# EAGLE design accel-sd-gyro (EAGLE 7.6.0)
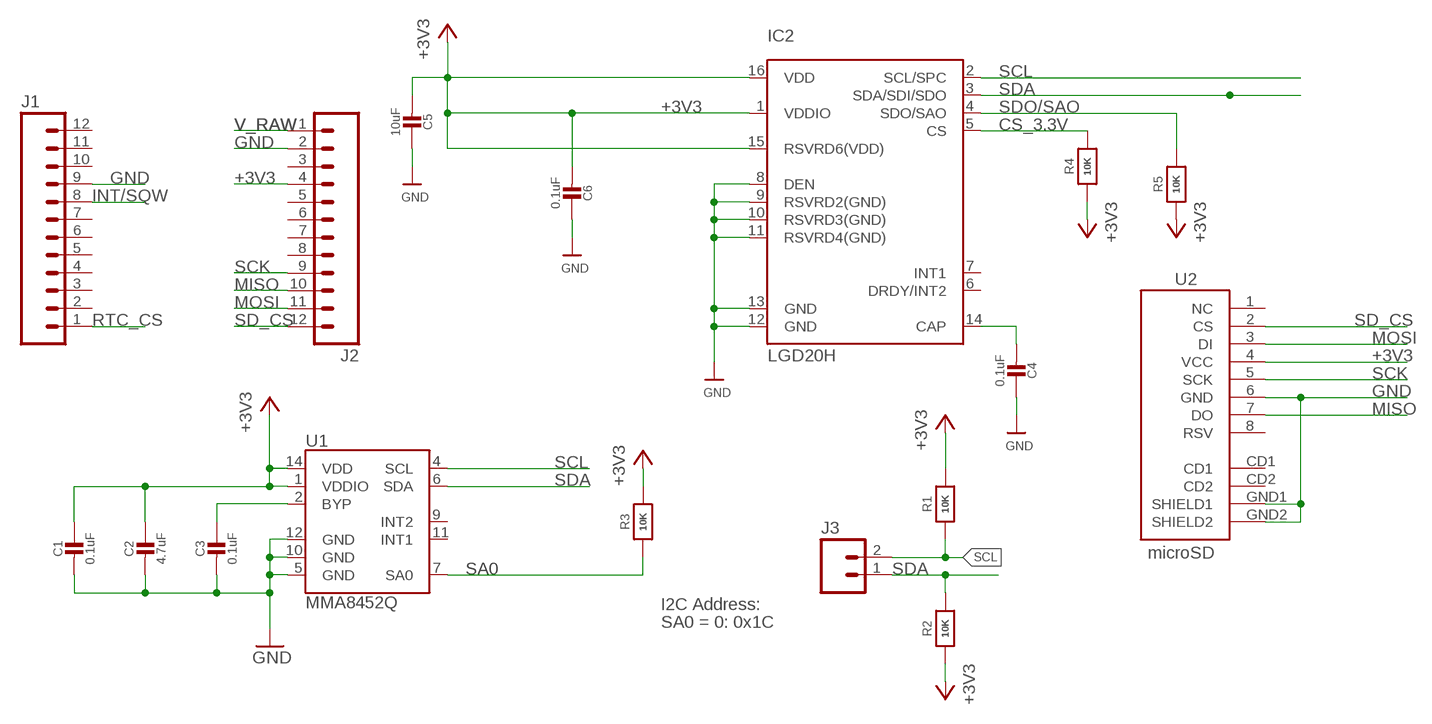
[diagram p0: schematic, sheet 1]

## Parts
C1  0.1uF  CAP_CERAMIC0805-NOOUTLINE  [0805-NO]
C2  4.7uF  CAP_CERAMIC0805-NOOUTLINE  [0805-NO]
C3  0.1uF  CAP_CERAMIC0805-NOOUTLINE  [0805-NO]
C4  0.1uF  CAP_CERAMIC0805-NOOUTLINE  [0805-NO]
C5  10uF  CAP_CERAMIC0805-NOOUTLINE  [0805-NO]
C6  0.1uF  CAP_CERAMIC0805-NOOUTLINE  [0805-NO]
IC2  LGD20H  GYRO_L3GD20H  [L3GD20H_LGA16L]
J1  M12PTH  [1X12]
J2  M12PTH  [1X12]
J3  M02LOCK  [1X02_LOCK]
R1  10K  RESISTOR0805_NOOUTLINE  [0805-NO]
R2  10K  RESISTOR0805_NOOUTLINE  [0805-NO]
R3  10K  RESISTOR_0805MP  [_0805MP]
R4  10K  RESISTOR0805_NOOUTLINE  [0805-NO]
R5  10K  RESISTOR0805_NOOUTLINE  [0805-NO]
U1  MMA8452Q  [QFN-16_0.5MM]
U2  microSD  USD-SOCKETSMD  [MICRO-SD-SOCKET-PP]

## Nets
+3V3: C1.1 C2.1 C5.2 C6.2 IC2.1(VDDIO) IC2.15(RSVRD6(VDD)) IC2.16(VDD) J2.4 R1.2 R2.1 R3.2 R4.1 R5.1 U1.1(VDDIO) U1.14(VDD) U2.4(VCC)
BYP: C3.1 U1.2(BYP)
CS_3.3V: IC2.5(CS) R4.2
GND: C1.2 C2.2 C3.2 C4.1 C5.1 C6.1 IC2.8(DEN) IC2.9(RSVRD2(GND)) IC2.10(RSVRD3(GND)) IC2.11(RSVRD4(GND)) IC2.12(GND) IC2.13(GND) J1.9 J2.2 U1.5(GND) U1.10(GND) U1.12(GND) U2.6(GND) U2.GND1(SHIELD1) U2.GND2(SHIELD2)
INT/SQW: J1.8
MISO: J2.10 U2.7(DO)
MOSI: J2.11 U2.3(DI)
N$3: C4.2 IC2.14(CAP)
RTC_CS: J1.1
SA0: R3.1 U1.7(SA0)
SCK: J2.9 U2.5(SCK)
SCL: IC2.2(SCL/SPC) J3.2 R1.1 U1.4(SCL)
SD_CS: J2.12 U2.2(CS)
SDA: IC2.3(SDA/SDI/SDO) J3.1 R2.2 U1.6(SDA)
SDO/SAO: IC2.4(SDO/SAO) R5.2
V_RAW: J2.1
Unconnected: IC2.6(DRDY/INT2) IC2.7(INT1) J1.2 J1.3 J1.4 J1.5 J1.6 J1.7 J1.10 J1.11 J1.12 J2.3 J2.5 J2.6 J2.7 J2.8 U1.9(INT2) U1.11(INT1) U2.1(NC) U2.8(RSV) U2.CD1 U2.CD2

## Notes on the sheet
- I2C Address:
- SA0 = 0: 0x1C

## Library data of the parts
C1-C6 = microbuilder:CAP_CERAMIC: Ceramic Capacitors For new designs, use the packages preceded by an '_' character since they are more reliable: The following footprints should be used on most boards: _0402 - Standard footprint for regular board layouts _0603 - Standard footprint for regular board layouts _0805 - Standard footprint for regular board layouts _1206 - Standard footprint for regular board layouts For extremely tight-pitch boards where space is at a premium, the following 'micro-pitch' footprints can be used (smaller pads, no silkscreen outline, etc.): _0402MP - Micro-pitch footprint for very dense/compact boards _0603MP - Micro-pitch footprint for very dense/compact boards _0805MP - Micro-pitch footprint for very dense/compact boards _1206MP - Micro-pitch footprint for very dense/compact boards
IC2 = microbuilder:GYRO_L3GD20H: L3GD20H - 3 Axis Gyro
J1 J2 = SparkFun-Connectors:M12: Header 12 Standard 12-pin 0.1" header. Use with straight break away headers (SKU : PRT-00116), right angle break away headers (PRT-00553), swiss pins (PRT-00743), machine pins (PRT-00117), and female headers (PRT-00115).
J3 = SparkFun-Connectors:M02: Standard 2-pin 0.1" header. Use with - straight break away headers ( PRT-00116) - right angle break away headers (PRT-00553) - swiss pins (PRT-00743) - machine pins (PRT-00117) - female headers (PRT-00115) Molex polarized connector foot print use with: PRT-08233 with associated crimp pins and housings. 2.54_SCREWTERM for use with PRT-10571. 3.5mm Screw Terminal footprints for PRT-08084 5mm Screw Terminal footprints for use with PRT-08432
R1-R5 = microbuilder:RESISTOR: Resistors For new designs, use the packages preceded by an '_' character since they are more reliable: The following footprints should be used on most boards: _0402 - Standard footprint for regular board layouts _0603 - Standard footprint for regular board layouts _0805 - Standard footprint for regular board layouts _1206 - Standard footprint for regular board layouts For extremely tight-pitch boards where space is at a premium, the following 'micro-pitch' footprints can be used (smaller pads, no silkscreen outline, etc.): _0402MP - Micro-pitch footprint for very dense/compact boards _0603MP - Micro-pitch footprint for very dense/compact boards _0805MP - Micro-pitch footprint for very dense/compact boards _1206MP - Micro-pitch footprint for very dense/compact boards
U1 = SparkFun:MMA8452Q: MMA8452Q 3-Axis, 12/8-bit Digital Accelerometer Supply Voltage: 1.6-3.6V Range: +/- 2g, 4g, 8g Interface: I2C, 12-bit and 8-bit ODR: 1.56 Hz - 800 Hz Package: QFN-16 http://cache.freescale.com/files/sensors/doc/data_sheet/MMA8452Q.pdf
U2 = SparkFun:USD-SOCKET: microSD Socket Push-push type uSD socket. Schematic element and footprint production proven. Spark Fun Electronics SKU : PRT-00127. tDoc lines correctly indicate media card edge positions when inserting (unlocked, locked, depressed).

## Net classes
1 vcc: width 0.254 mm

## Board
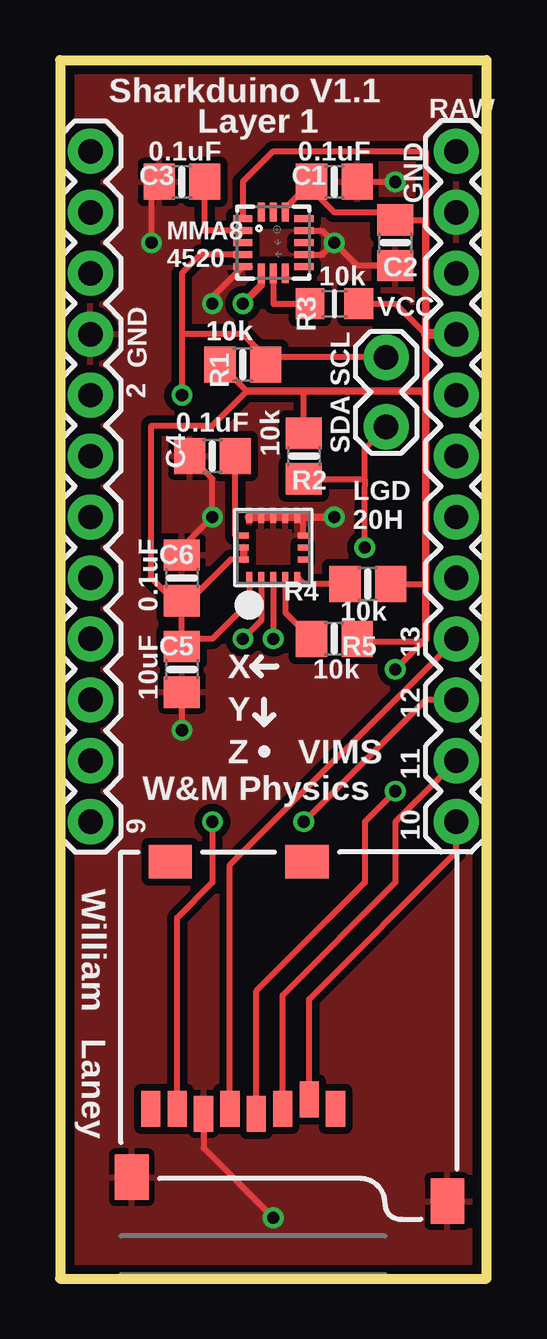
[diagram p1: board, top side]
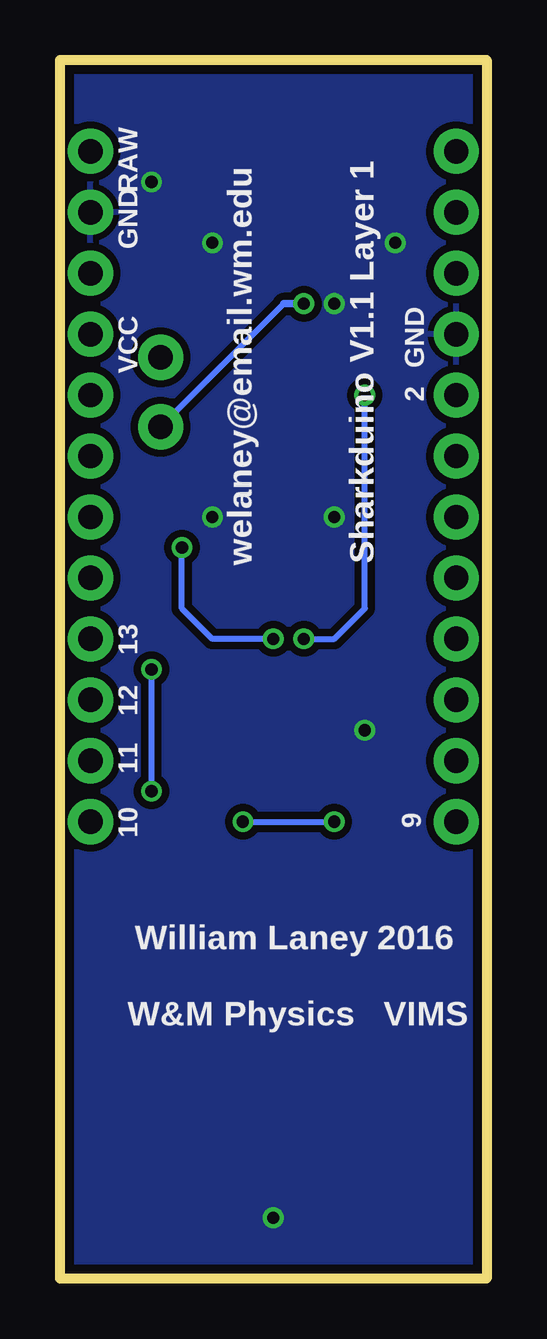
[diagram p2: board, bottom side, seen from below]

Size 17.78 x 50.8 mm. Coordinates in mm from the lower left corner, seen from the top.
Outline: 0,50.8 17.78,50.8 17.78,0 0,0 0,50.8
Copper layers (1*16): Top 0.0356mm / dielectric 1.5011mm / Bottom 0.0356mm
Design rules "oshpark-2layer": minimum track width 6mil, minimum drill 13mil, track to track 6mil, track to pad 6mil, pad to pad 6mil, via to via 6mil, smd to smd 6mil, copper to edge 15mil, drill to drill 6mil, minimum pad ring 7mil, minimum via ring 7mil, stop-mask expansion 2.5mil, vias tented up to drill 0mil, thermal gap 10mil

### Footprints (pad centres in the part's own frame; a part is rotated, then mirrored left to right if it is on the bottom)
0805-NO = smd 1.3 x 1.5: 1 -0.95,0; 2 0.95,0
L3GD20H_LGA16L = smd 0.4 x 0.25: 1 -1.225,1; 2 -1.225,0.5; 3 -1.225,0; 4 -1.225,-0.5; 5 -1.225,-1; 9 1.225,-1; 10 1.225,-0.5; 11 1.225,0; 12 1.225,0.5; 13 1.225,1 | smd 0.25 x 0.4: 6 -0.5,-1.225; 7 0,-1.225; 8 0.5,-1.225; 14 0.5,1.225; 15 0,1.225; 16 -0.5,1.225
1X12 = drill 1.016 pad 1.88: 1 0,0; 2 2.54,0; 3 5.08,0; 4 7.62,0; 5 10.16,0; 6 12.7,0; 7 15.24,0; 8 17.78,0; 9 20.32,0; 10 22.86,0; 11 25.4,0; 12 27.94,0
1X02_LOCK = drill 1.016 pad 1.88: 1 -0.178,0; 2 2.718,0
_0805MP = smd 1.2 x 1.3: 1 -1.016,0; 2 1.016,0
QFN-16_0.5MM = smd 0.8 x 0.3: 1 -1.275,1; 2 -1.275,0.5; 3 -1.275,0; 4 -1.275,-0.5; 5 -1.275,-1; 9 1.275,-1; 10 1.275,-0.5; 11 1.275,0; 12 1.275,0.5; 13 1.275,1 | smd 0.3 x 0.8: 6 -0.5,-1.275; 7 0,-1.275; 8 0.5,-1.275; 14 0.5,1.275; 15 0,1.275; 16 -0.5,1.275
MICRO-SD-SOCKET-PP = smd 0.8 x 1.5: 1 -8.94,10.7; 2 -7.84,10.3; 3 -6.74,10.7; 4 -5.64,10.9; 5 -4.54,10.7; 6 -3.44,10.9; 7 -2.34,10.7; 8 -1.24,10.7 | smd 1.8 x 1.4: CD1 -7.75,0.4; CD2 -2.05,0.4 | smd 1.4 x 1.9: GND1 -13.6,14.55; GND2 -0.45,13.55

### Placement (x,y rotation side)
C1  11.43,45.72 0 top
C2  13.97,43.18 270 top
C3  5.08,45.72 180 top
C4  6.35,34.29 0 top
C5  5.08,25.4 90 top
C6  5.08,29.21 270 top
IC2  8.89,30.48 90 top
J1  1.27,19.05 90 top
J2  16.51,46.99 270 top
J3  13.59,35.69 90 top
R1  7.62,38.1 180 top
R2  10.16,34.29 270 top
R3  11.43,40.64 0 top
R4  12.83,28.96 180 top
R5  11.43,26.67 180 top
U1  8.89,43.18 0 top
U2  2.54,17.78 180 top

### Tracks (layer width: path | path; a pad name or v marks a point on that pad's centre or on a via)
+3V3  (via drill 0.51)
  Top 0.254: C5.2 5.08,27.94 | IC2.1 7.89,28.21 6.35,26.67 5.4,26.67 | IC2.16 7.12,29.98 5.08,27.94 | R1.2 7.78,36.99 6.35,35.56 3.81,35.56 3.81,29.21 5.08,27.94 | R3.2 13.97,40.64 15.24,39.37 | U1.1 7.62,45.72 8.89,46.99 15.24,46.99 15.24,44.13 C2.1 13.65,44.45 11.43,44.45 10.48,45.4 C1.1 9.39,44.63 U1.14 | R4.1 15.11,28.96 15.24,28.83 | R2.1 10.16,36.99 | v13.97,20.32 12.7,19.05 12.7,16.51 8.18,11.99 U2.4 | R5.1 12.51,26.54 15.11,26.54 v13.97,25.4
  Top 0.305: 5.08,27.94 C6.2 | 5.4,26.67 C5.2 | IC2.15 IC2.16 | 15.24,44.13 15.24,39.37 15.24,36.83 | 15.11,26.54 15.24,26.67 15.24,28.83 15.24,36.83 | 7.78,36.99 10.16,36.99 15.08,36.99 15.24,36.83
  Top 0.406: J2.4 15.24,39.37
  Bottom 0.254: v13.97,25.4 v13.97,20.32
BYP
  Top 0.254: U1.2 6.03,43.68 C3.1
CS_3.3V
  Top 0.254: 9.94,29.21 IC2.5 10.19,28.96 R4.2
GND  (via drill 0.51)
  Top 0.254: U2.6 5.98,5.45 v8.89,2.54 | U2.GND2 2.54,4.23 | 16.14,2.54 U2.GND1 | IC2.8 10.12,31.7 IC2.9 IC2.10 IC2.11 IC2.12 IC2.13 7.84,31.75 | C6.1 5.08,30.48 v6.35,31.75 6.35,33.34 C4.1 | v6.35,40.64 6.35,40.92 U1.5 | C5.1 v5.08,22.86 | C3.2 3.81,45.72 v3.81,43.18 | U1.10 10.93,42.68 v11.43,43.18 | v11.43,43.18 12.38,42.23 C2.2 | U1.12 10.93,43.68 v11.43,43.18 | C1.2 v13.97,45.72
  Top 0.305: U1.5 7.89,42.18 | 7.84,31.75 v11.43,31.75
  pour Bottom (isolate 0.305): 0,50.8 17.78,50.8 17.78,0 0,0
  pour Top (isolate 0.305): 0,50.8 17.78,50.8 17.78,0 0,0
MISO  (via drill 0.51)
  Top 0.254: 5.08,7.08 U2.7 4.88,15.04 6.35,16.51 v6.35,19.05 | J2.10 15.24,24.13 v10.16,19.05
  Bottom 0.254: v10.16,19.05 v6.35,19.05
MOSI
  Top 0.254: J2.11 13.97,19.05 13.97,16.51 9.28,11.82 U2.3
N$3
  Top 0.254: IC2.14 7.3,30.98 C4.2
SA0
  Top 0.254: U1.7 8.89,40.64 R3.1
SCK
  Top 0.254: U2.5 7.08,17.24 J2.9
SCL  (via drill 0.51)
  Top 0.254: J3.2 8.88,38.41 | IC2.2 8.39,27.44 v7.62,26.67 | U1.4 5.85,42.68 5.08,41.91 5.08,39.37 | 5.08,39.37 v5.08,36.83 | 8.57,38.42 7.62,39.37 5.08,39.37
  Top 0.305: 8.88,38.41 R1.1 8.57,38.42
  Bottom 0.254: v7.62,26.67 6.35,26.67 5.08,27.94 v5.08,36.83 | 13.28,38.1 J3.2
SD_CS
  Top 0.254: U2.2 10.38,11.65 16.51,17.78 J2.12
SDA  (via drill 0.51)
  Top 0.254: IC2.3 v8.89,26.67 | J3.1 12.69,34.61 12.69,33.34 | v12.7,30.48 v12.69,30.48 12.69,33.02 12.69,33.34 | R2.2 12.69,33.34
  Top 0.305: U1.6 8.39,41.41 v7.62,40.64
  Bottom 0.254: 8.46,40.64 J3.1 | v8.89,26.67 11.43,26.67 12.7,27.94 v12.7,30.48
  Bottom 0.305: v7.62,40.64 8.46,40.64
SDO/SAO
  Top 0.254: IC2.4 9.39,27.76 R5.2

### Text on the board
tPlace: Sharkduino V1.1 | RAW | Layer 1 | 0.1uF | 0.1uF | GND | MMA8 / 4520 | 10k | GND | VCC | 10k | 10k | SCL | 2 | 0.1uF | 10k | SDA | LGD / 20H | 0.1uF | 10k | 13 | X | 10k | 10uF | Y | 12 | Z | VIMS | 11 | W&M Physics | 9 | 10 | William | Laney
bPlace: RAW | Sharkduino V1.1 Layer 1 | welaney@email.wm.edu | GND | GND | VCC | 2 | 13 | 12 | 11 | 9 | 10 | William Laney 2016 | W&M Physics VIMS